# Altium project Altium.PrjPcb
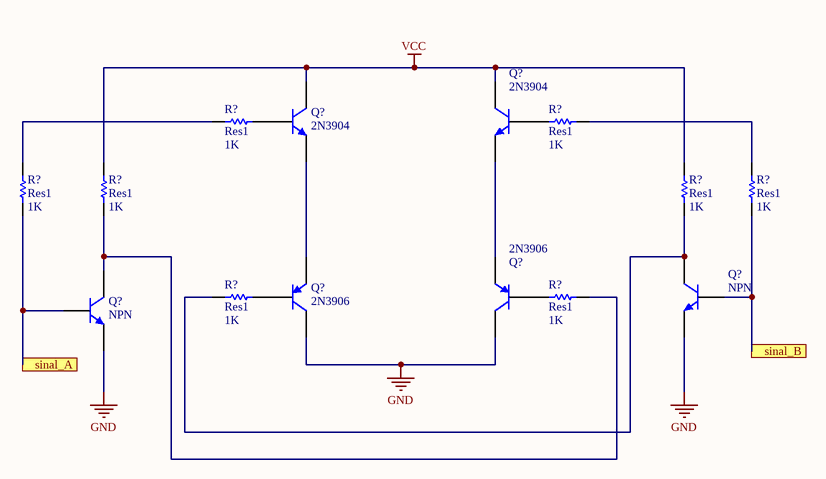
[diagram p0: Sheet1.SchDoc]
1 sheet, 14 parts. Net scope: flat (ports and power ports of the same name join across sheets).

## Sheet Sheet1.SchDoc
size A4

### Parts
(Parts that share a designator on the sheet are numbered #1, #2 ... from top to bottom, then left to right.)
Q?#1  2N3904  [TO-92A]
Q?#2  2N3904  [TO-92A]
Q?#3  2N3906  [TO-92A]
Q?#4  2N3906  [TO-92A]
Q?#5  NPN  [TO-226-AA]
Q?#6  NPN  [TO-226-AA]
R?#1  Res1  value 1K  [AXIAL-0.3]
R?#2  Res1  value 1K  [AXIAL-0.3]
R?#3  Res1  value 1K  [AXIAL-0.3]
R?#4  Res1  value 1K  [AXIAL-0.3]
R?#5  Res1  value 1K  [AXIAL-0.3]
R?#6  Res1  value 1K  [AXIAL-0.3]
R?#7  Res1  value 1K  [AXIAL-0.3]
R?#8  Res1  value 1K  [AXIAL-0.3]

### Ports
sinal_A, sinal_B

### Nets
GND: Q?#3.3(C) Q?#4.3(C) Q?#5.3(E) Q?#6.3(E)
VCC: Q?#1.3(C) Q?#2.3(C) R?#4.1 R?#5.1
NetQ?#1_1: Q?#1.1(E) Q?#3.1(E)
NetQ?#1_2: Q?#1.2(B) R?#1.2
NetQ?#2_1: Q?#2.1(E) Q?#4.1(E)
NetQ?#2_2: Q?#2.2(B) R?#2.1
NetQ?#3_2: Q?#3.2(B) R?#7.2
NetQ?#4_2: Q?#4.2(B) R?#8.1
NetQ?#5_1: Q?#5.1(C) R?#5.2 R?#7.1
NetQ?#5_2: Q?#5.2(B) R?#6.2 ; port sinal_B
NetQ?#6_1: Q?#6.1(C) R?#4.2 R?#8.2
NetQ?#6_2: Q?#6.2(B) R?#3.2 ; port sinal_A
NetR?#1_1: R?#1.1 R?#3.1
NetR?#2_2: R?#2.2 R?#6.1

### Library data of the parts
Q?#1 Q?#2 = 2N3904: NPN General Purpose Amplifier; Published: 8-Jun-2000; LatestRevisionDate: 15-Jan-2003; LatestRevisionNote: PCB Footprint 'BCY-W3/D4.7' replaced; DatasheetVersion: 1997; PackageVersion: Sep-1998; PackageReference: TO-92A; Publisher: Altium Limited; PackageDescription: TO, Flat Index; 3 In-Line, Axial Leads; Body Dia. 4.5mm; Leads 0.51 x 0.48 mm (max); ComponentLink1Description: Manufacturer Link; ComponentLink1URL: http://www.fairchildsemi.com/; ComponentLink2Description: Datasheet; ComponentLink2URL: http://www.fairchildsemi.com/ds/2N%2F2N3904.pdf
Q?#3 Q?#4 = 2N3906: PNP General Purpose Amplifier; Published: 8-Jun-2000; LatestRevisionDate: 15-Jan-2003; LatestRevisionNote: PCB Footprint 'BCY-W3/D4.7' replaced; DatasheetVersion: 1997; PackageVersion: Sep-1998; PackageReference: TO-92A; Publisher: Altium Limited; PackageDescription: TO, Flat Index; 3 In-Line, Axial Leads; Body Dia. 4.5mm; Leads 0.51 x 0.48 mm (max); ComponentLink1Description: Manufacturer Link; ComponentLink1URL: http://www.fairchildsemi.com/; ComponentLink2Description: Datasheet; ComponentLink2URL: http://www.fairchildsemi.com/ds/2N%2F2N3906.pdf
Q?#5 Q?#6 = NPN: NPN Bipolar Transistor; Published: 8-Jun-2000; LatestRevisionDate: 17-Jul-2002; LatestRevisionNote: Re-released for DXP Platform.; PackageReference: TO-226-AA; Publisher: Altium Limited; PackageDescription: TO, Flat Index; 3 In-Line, Axial Leads; Body Dia. 4.8mm; Leads 0.55 x 0.51 mm (max); Code_JEDEC: TO-226-AA
R?#1-R?#8 = Res1: Resistor; Published: 8-Jun-2000; LatestRevisionDate: 17-Jul-2002; LatestRevisionNote: Re-released for DXP Platform.; PackageReference: AXIAL-0.3; Publisher: Altium Limited; PackageDescription: Axial Device, Thru-Hole; 2 Leads; 0.3 in Pin Spacing